# EAGLE design FPVCaptureTheFlag (EAGLE 8.6.0)
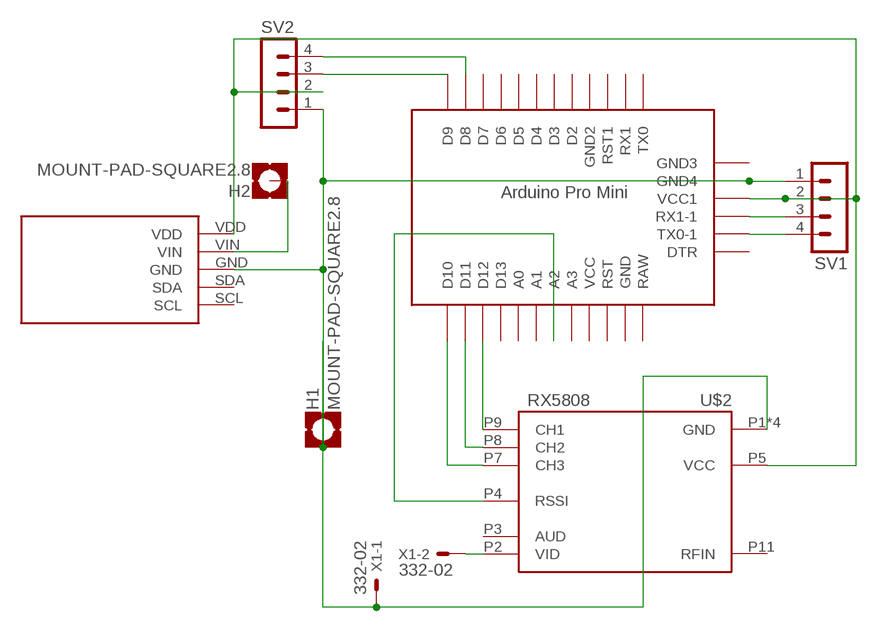
[diagram p0: schematic, sheet 1]

## Parts
H1  MOUNT-PAD-SQUARE2.8  [2,8-PAD-SQUARE]
H2  MOUNT-PAD-SQUARE2.8  [2,8-PAD-SQUARE]
SV1  MA04-1  [MA04-1]
SV2  MA04-1  [MA04-1]
U$1  ABK-PRO-MINI  [ABK-PRO-MINI]
U$2  RX5808  [RX5808]
U$3  POLOLU_MINIMU9_V2THROUGHHOLE  [POLOLU_MINIMU9_V2]
X1  332-02  [332-02]

## Nets
N$1: U$1.D12 U$2.P9(CH1)
N$2: U$1.D11 U$2.P8(CH2)
N$3: U$1.D10 U$2.P7(CH3)
N$4: U$1.A2 U$2.P4(RSSI)
N$5: SV2.4 U$1.D8
N$6: SV2.3 U$1.D9
N$7: H2.B2,8(MOUNT) U$3.VIN
N$10: SV1.3 U$1.RX1-1
N$11: SV1.4 U$1.TX0-1
N$12: H1.B2,8(MOUNT) SV1.1 SV2.1 U$1.GND3(GND4) U$2.P1(GND) U$2.P6(GND) U$2.P10(GND) U$2.P12(GND) U$3.GND X1.1
N$13: U$2.P2(VID) X1.2
N$14: SV1.2 SV2.2 U$1.VCC1 U$2.P5(VCC) U$3.VDD
Unconnected: U$1.A0 U$1.A1 U$1.A3 U$1.D2 U$1.D3 U$1.D4 U$1.D5 U$1.D6 U$1.D7 U$1.D13 U$1.DTR U$1.GND U$1.GND1(GND2) U$1.GND2(GND3) U$1.RAW U$1.RST U$1.RST1 U$1.RX1 U$1.TX0 U$1.VCC U$2.P3(AUD) U$2.P11(RFIN) U$3.SCL U$3.SDA

## Library data of the parts
H1 H2 = holes:MOUNT-PAD-SQUARE: MOUNTING PAD, square
SV1 SV2 = con-lstb:MA04-1: PIN HEADER; OC_FARNELL: unknown; OC_NEWARK: unknown
U$1 = Arduino-clone:ABK-PRO-MINI: ABK Pro-Mini Arduino Clone
U$2 = boscam:RX5808
U$3 = pololu:POLOLU_MINIMU9_V2
X1 = con-garry:332-02: 2 Pin - 2mm Dual Row Source: www.mpe-connector.de / garry_shortform_2012.pdf

## Board
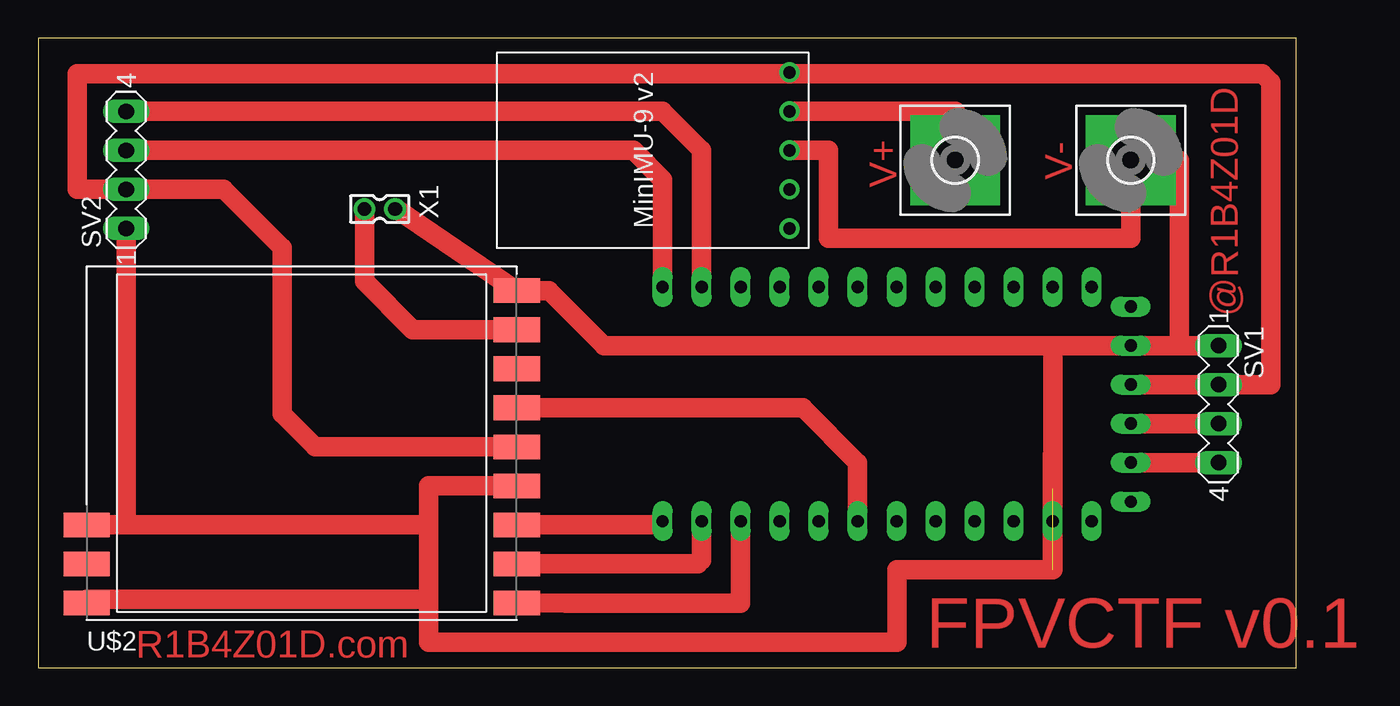
[diagram p1: board, top side]

Size 81.89 x 40.94 mm. Coordinates in mm from the lower left corner, seen from the top.
Outline: 0,0 81.89,0 81.89,40.94 0,40.94 0,0
Copper layers (1*16): Top 0.035mm / dielectric 1.5mm / Bottom 0.035mm
Design rules "default": minimum track width 6mil, minimum drill 0.35mm, track to track 6mil, track to pad 6mil, pad to pad 6mil, via to via 6mil, smd to smd 6mil, copper to edge 40mil, drill to drill 6mil, minimum pad ring 10mil, minimum via ring 8mil, stop-mask expansion 4mil, vias tented up to drill 0mil, thermal gap 10mil

### Footprints (pad centres in the part's own frame; a part is rotated, then mirrored left to right if it is on the bottom)
2,8-PAD-SQUARE = drill 2.8 pad 5.842 square: B2,8 0,0
MA04-1 = drill 1.016 long: 1 -3.81,0; 2 -1.27,0; 3 1.27,0; 4 3.81,0
ABK-PRO-MINI = drill 0.8 long: A0 10.16,-3.81; A1 10.16,-6.35; A2 10.16,-8.89; A3 10.16,-11.43; D2 -5.08,-3.81; D3 -5.08,-6.35; D4 -5.08,-8.89; D5 -5.08,-11.43; D6 -5.08,-13.97; D7 -5.08,-16.51; D8 -5.08,-19.05; D9 -5.08,-21.59; D10 10.16,-21.59; D11 10.16,-19.05; D12 10.16,-16.51; D13 10.16,-13.97; DTR 8.89,8.89; GND 10.16,3.81; GND1 -5.08,-1.27; GND2 -3.81,8.89; GND3 -1.27,8.89; RAW 10.16,6.35; RST 10.16,1.27; RST1 -5.08,1.27; RX1 -5.08,3.81; RX1-1 3.81,8.89; TX0 -5.08,6.35; TX0-1 6.35,8.89; VCC 10.16,-1.27; VCC1 1.27,8.89
RX5808 = smd 3 x 1.6: P1 14,9.92; P2 14,7.38; P3 14,4.84; P4 14,2.3; P5 14,-0.24; P6 14,-2.78; P7 14,-5.32; P8 14,-7.86; P9 14,-10.4; P10 -14,-5.32; P11 -14,-7.86; P12 -14,-10.4
POLOLU_MINIMU9_V2 = drill 0.8: GND 6.35,1.27; SCL 1.27,1.27; SDA 3.81,1.27; VDD 11.43,1.27; VIN 8.89,1.27
332-02 = drill 0.9 pad 1.27: 1 0,-1; 2 0,1

### Placement (x,y rotation side)
H1  71.12,33.02 0 top
H2  59.69,33.02 0 top
SV1  76.83,17.14 270 top
SV2  5.71,32.39 90 top
U$1  62.23,19.68 270 top
U$2  17.14,14.6 0 top
U$3  50.17,27.3 90 top
X1  22.22,29.84 90 top

### Tracks (layer width: path | path; a pad name or v marks a point on that pad's centre or on a via)
N$1
  Top 1.27: U$1.D12 45.72,4.19 34.33,4.19 U$2.P9
N$2
  Top 1.27: U$2.P8 42.94,6.74 43.18,6.98 U$1.D11
N$3
  Top 1.27: U$1.D10 40.4,9.29 U$2.P7
N$4
  Top 1.27: U$2.P4 49.77,16.9 53.34,13.33 U$1.A2
N$5
  Top 1.27: SV2.4 40.64,36.19 43.18,33.66 U$1.D8
N$6
  Top 1.27: U$1.D9 40.64,31.75 38.73,33.66 SV2.3
N$7
  Top 1.27: H2.B2,8 59.69,36.19 U$3.VIN
N$10
  Top 1.27: U$1.RX1-1 SV1.3
N$11
  Top 1.27: U$1.TX0-1 SV1.4
N$12  (1 unrouted)
  Top 1.27: 66.04,20.96 36.83,20.96 33.26,24.52 U$2.P1 23.29,29.84 X1.1 | 66.04,20.96 U$1.GND3 74.3,20.96 | 74.3,20.96 SV1.1 | 74.3,20.96 74.3,33.02 H1.B2,8 71.12,27.94 51.44,27.94 51.44,33.66 U$3.GND | 66.04,20.96 66.04,11.62 | SV2.1 5.71,9.29 U$2.P10 25.4,9.29 | U$2.P6 25.4,11.82 25.4,9.29 | U$2.P12 3.15,4.44 25.4,4.44 | 25.4,4.44 25.4,9.29 | 25.4,4.44 25.4,1.65 55.88,1.65 55.88,6.35 66.04,6.35
N$13
  Top 1.27: X1.2 21.22,25.13 24.37,21.98 U$2.P2
N$14
  Top 1.27: 48.97,38.66 2.54,38.66 2.54,31.11 SV2.2 12.07,31.11 15.88,27.3 15.88,16.51 18.02,14.36 U$2.P5 | 48.97,38.66 U$3.VDD | 48.97,38.66 79.69,38.66 80.24,38.1 80.24,18.41 SV1.2 U$1.VCC1
(copper drawn outside any net)
  shapes: Top area x1

### Text on the board
Top: V+ | V- | @R1B4Z01D | FPVCTF v0.1 | R1B4Z01D.com